# EAGLE design LCD (EAGLE 7.1.0)
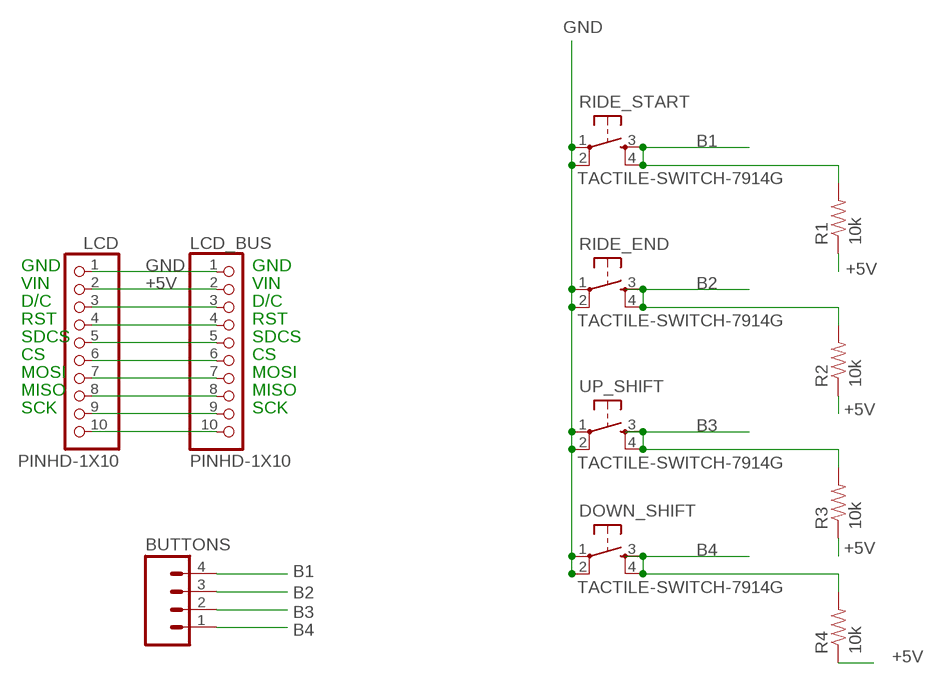
[diagram p0: schematic, sheet 1]

## Parts
BUTTONS  M04LONGPADS  [1X04_LONGPADS]
DOWN_SHIFT  TACTILE-SWITCH-7914G  [7914G]
LCD  PINHD-1X10  [1X10-BIG]
LCD_BUS  PINHD-1X10  [1X10-BIG]
R1  10k  RESISTOR0805-RES  [0805]
R2  10k  RESISTOR0805-RES  [0805]
R3  10k  RESISTOR0805-RES  [0805]
R4  10k  RESISTOR0805-RES  [0805]
RIDE_END  TACTILE-SWITCH-7914G  [7914G]
RIDE_START  TACTILE-SWITCH-7914G  [7914G]
UP_SHIFT  TACTILE-SWITCH-7914G  [7914G]

## Nets
+5V: LCD.2 LCD_BUS.2 R1.1 R2.1 R3.1 R4.1
B1: BUTTONS.4 R1.2 RIDE_START.3 RIDE_START.4
B2: BUTTONS.3 R2.2 RIDE_END.3 RIDE_END.4
B3: BUTTONS.2 R3.2 UP_SHIFT.3 UP_SHIFT.4
B4: BUTTONS.1 DOWN_SHIFT.3 DOWN_SHIFT.4 R4.2
GND: DOWN_SHIFT.1 DOWN_SHIFT.2 LCD.1 LCD_BUS.1 RIDE_END.1 RIDE_END.2 RIDE_START.1 RIDE_START.2 UP_SHIFT.1 UP_SHIFT.2
N$3: LCD.3 LCD_BUS.3
N$4: LCD.4 LCD_BUS.4
N$5: LCD.5 LCD_BUS.5
N$6: LCD.6 LCD_BUS.6
N$7: LCD.7 LCD_BUS.7
N$8: LCD.8 LCD_BUS.8
N$9: LCD.9 LCD_BUS.9
N$10: LCD.10 LCD_BUS.10

## Notes on the sheet
- GND | GND
- VIN | VIN
- D/C | D/C
- RST | RST
- SDCS | SDCS
- CS | CS
- MOSI | MOSI
- MISO | MISO
- SCK | SCK

## Library data of the parts
BUTTONS = SparkFun-Connectors:M04: Header 4 Standard 4-pin 0.1" header. Use with straight break away headers (SKU : PRT-00116), right angle break away headers (PRT-00553), swiss pins (PRT-00743), machine pins (PRT-00117), and female headers (PRT-00115). Molex polarized connector foot print use with SKU : PRT-08231 with associated crimp pins and housings. 1MM SMD Version SKU: PRT-10208
DOWN_SHIFT RIDE_END RIDE_START UP_SHIFT = GeekAmmo:TACTILE-SWITCH: Tactile Switch 4 Pins, SPST NO
LCD LCD_BUS = adafruit:PINHD-1X10: Pin header 1x10 0.1" spacing With round pins
R1-R4 = SparkFun-Passives:RESISTOR: Resistor Basic schematic elements and footprints for 0603, 1206, and PTH resistors.

## Board
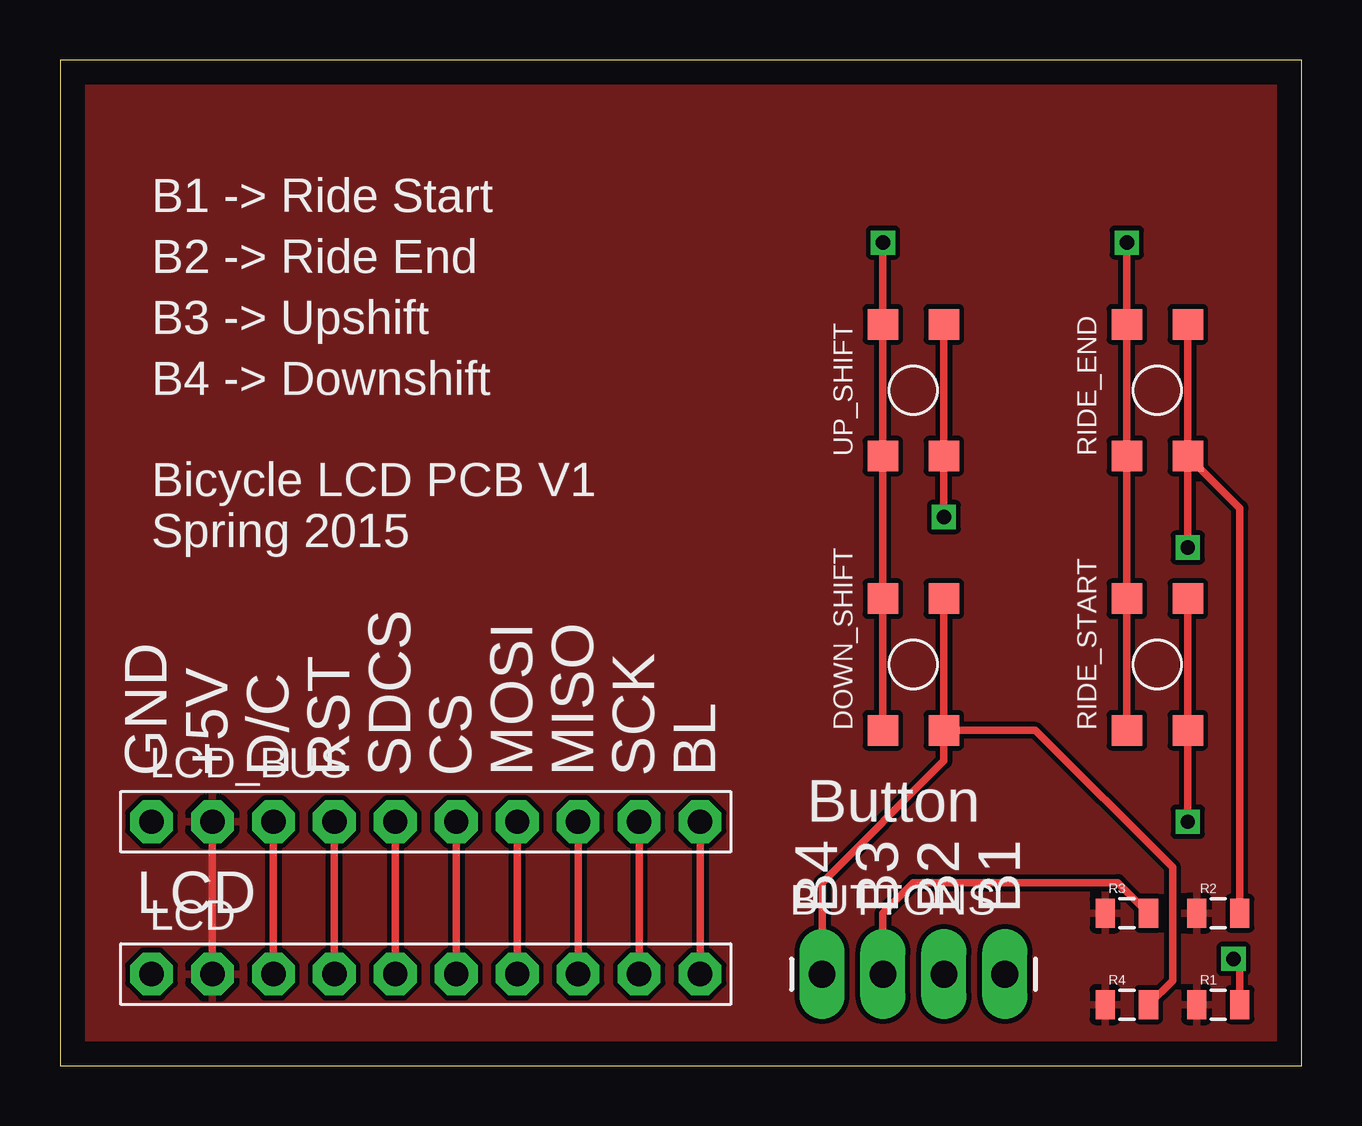
[diagram p1: board, top side]
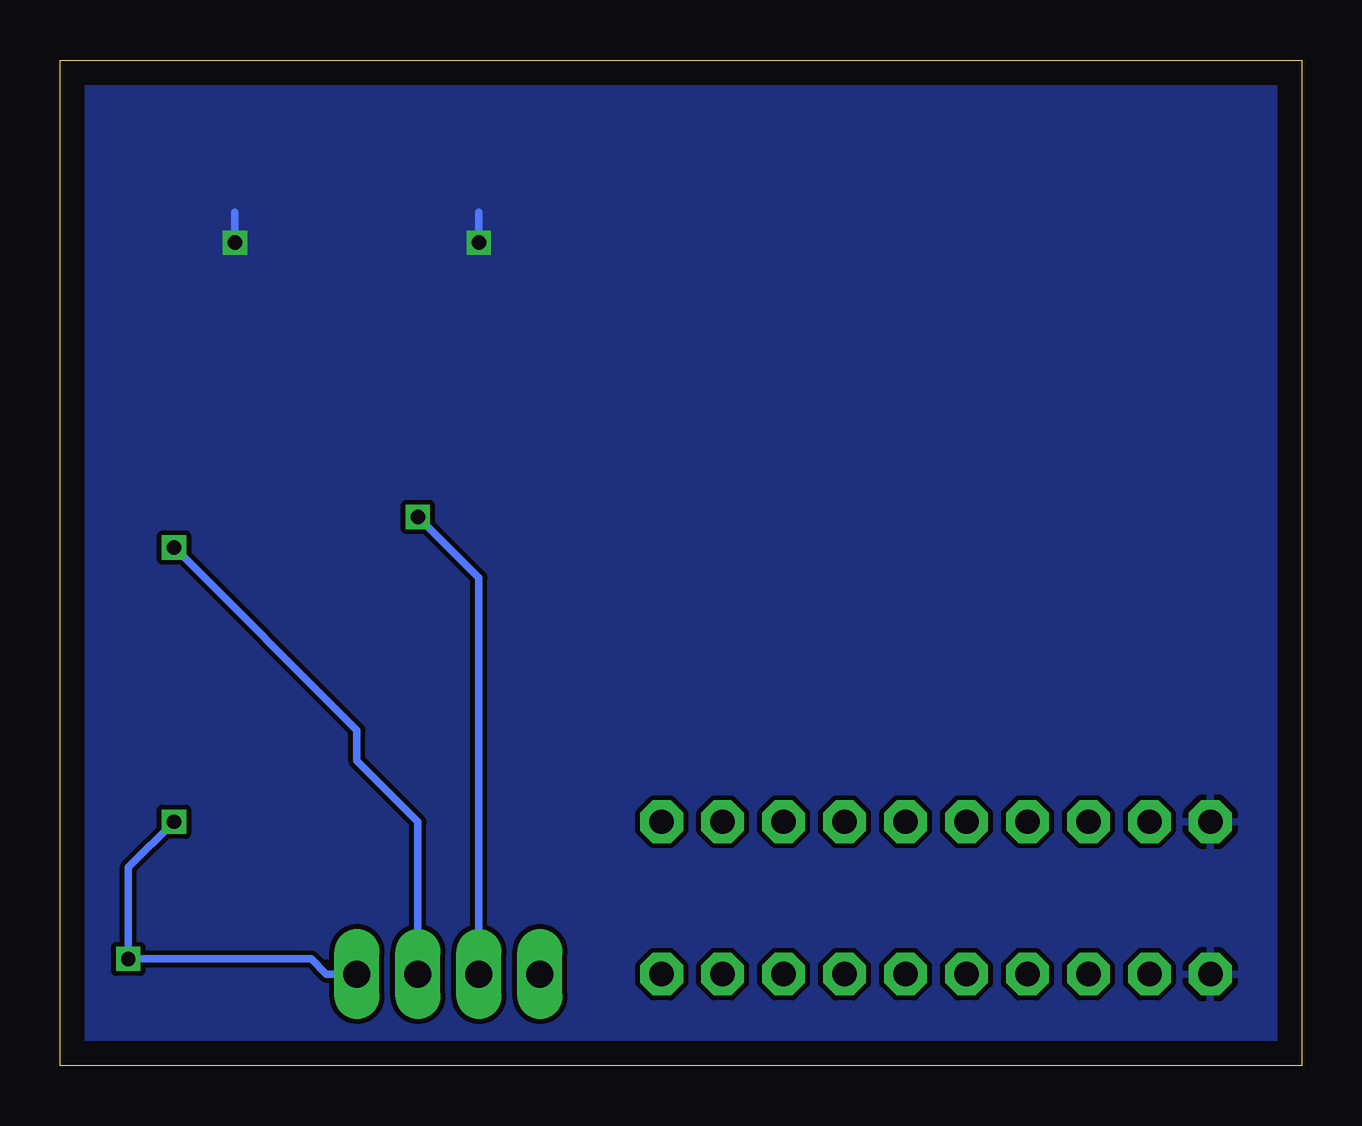
[diagram p2: board, bottom side, seen from below]

Size 51.74 x 41.9 mm. Coordinates in mm from the lower left corner, seen from the top.
Outline: 0,0 51.74,0 51.74,41.9 0,41.9 0,0
Copper layers (1*16): Top 0.035mm / dielectric 1.5mm / Bottom 0.035mm
Design rules "default": minimum track width 10mil, minimum drill 24mil, track to track 8mil, track to pad 8mil, pad to pad 8mil, via to via 8mil, smd to smd 8mil, copper to edge 40mil, drill to drill 8mil, minimum pad ring 10mil, minimum via ring 8mil, stop-mask expansion 4mil, vias tented up to drill 0mil, thermal gap 10mil

### Footprints (pad centres in the part's own frame; a part is rotated, then mirrored left to right if it is on the bottom)
1X04_LONGPADS = drill 1.118 pad 1.88 long: 1 0,0; 2 2.54,0; 3 5.08,0; 4 7.62,0
7914G = smd 1.27 x 1.27: 1 0,0; 2 0,5.486; 3 2.54,0; 4 2.54,5.486
1X10-BIG = drill 1.016 pad 1.778 octagon: 1 -11.43,0; 2 -8.89,0; 3 -6.35,0; 4 -3.81,0; 5 -1.27,0; 6 1.27,0; 7 3.81,0; 8 6.35,0; 9 8.89,0; 10 11.43,0
0805 = smd 0.8 x 1.2: 1 -0.9,0; 2 0.9,0

### Placement (x,y rotation side)
BUTTONS  31.75,3.81 0 top
DOWN_SHIFT  34.29,13.97 0 top
LCD  15.24,3.81 0 top
LCD_BUS  15.24,10.16 0 top
R1  48.26,2.54 0 top
R2  48.26,6.35 0 top
R3  44.45,6.35 0 top
R4  44.45,2.54 0 top
RIDE_END  44.45,25.4 0 top
RIDE_START  44.45,13.97 0 top
UP_SHIFT  34.29,25.4 0 top

### Tracks (layer width: path | path; a pad name or v marks a point on that pad's centre or on a via)
+5V
  Top 0.305: LCD.2 LCD_BUS.2
  pour Top: -2.54,43.18 53.34,43.18 53.34,-5.08 -2.54,-5.08
B1  (via drill 0.6)
  Top 0.305: R1.2 49.16,4.18 v48.9,4.45 | v46.99,10.16 RIDE_START.3 RIDE_START.4
  Bottom 0.305: v46.99,10.16 48.9,8.26 v48.9,4.45 41.27,4.45 40.64,3.81 BUTTONS.4
B2  (via drill 0.6)
  Top 0.305: R2.2 49.16,23.23 RIDE_END.3 | RIDE_END.4 RIDE_END.3 | v46.99,21.59 RIDE_END.3
  Bottom 0.305: BUTTONS.3 36.83,10.16 39.37,12.7 39.37,13.97 v46.99,21.59
B3  (via drill 0.6)
  Top 0.305: R3.2 44.08,7.62 35.56,7.62 34.29,6.35 BUTTONS.2 | v36.83,22.86 UP_SHIFT.3 UP_SHIFT.4
  Bottom 0.305: BUTTONS.2 34.29,20.32 v36.83,22.86
  other vias: 34.29,3.81
B4
  Top 0.305: DOWN_SHIFT.4 DOWN_SHIFT.3 | DOWN_SHIFT.3 36.83,12.7 31.75,7.62 BUTTONS.1 | R4.2 46.35,3.54 46.35,8.26 40.64,13.97 DOWN_SHIFT.3
GND  (via drill 0.6)
  Top 0.305: DOWN_SHIFT.1 DOWN_SHIFT.2 UP_SHIFT.1 UP_SHIFT.2 v34.29,34.29 | v44.45,34.29 RIDE_END.2 RIDE_END.1 RIDE_START.2 RIDE_START.1
  Bottom 0.305: v34.29,34.29 34.29,35.56 | v44.45,34.29 44.45,35.56
  pour Bottom: -1.27,43.18 55.88,43.18 55.88,-5.08 -1.27,-5.08
N$3
  Top 0.305: LCD_BUS.3 LCD.3
N$4
  Top 0.305: LCD.4 LCD_BUS.4
N$5
  Top 0.305: LCD_BUS.5 LCD.5
N$6
  Top 0.305: LCD_BUS.6 LCD.6
N$7
  Top 0.305: LCD.7 LCD_BUS.7
N$8
  Top 0.305: LCD_BUS.8 LCD.8
N$9
  Top 0.305: LCD.9 LCD_BUS.9
N$10
  Top 0.305: LCD_BUS.10 LCD.10

### Text on the board
tPlace: B1 -> Ride Start | B2 -> Ride End | B3 -> Upshift | B4 -> Downshift | Bicycle LCD PCB V1 / Spring 2015 | GND | +5V | D/C | RST | SDCS | CS | MOSI | MISO | SCK | BL | Button | LCD | B4 | B3 | B2 | B1